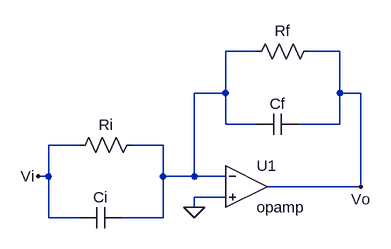
[diagram p0: schematic esercizio3.asc]
esercizio3.asc, the LTspice schematic file:
Version 4
SHEET 1 880 680
WIRE 224 -16 176 -16
WIRE 352 -16 304 -16
WIRE 176 48 176 -16
WIRE 176 48 128 48
WIRE 352 48 352 -16
WIRE 384 48 352 48
WIRE 176 96 176 48
WIRE 224 96 176 96
WIRE 352 96 352 48
WIRE 352 96 288 96
WIRE -48 128 -96 128
WIRE 80 128 32 128
WIRE -96 176 -96 128
WIRE -96 176 -112 176
WIRE 80 176 80 128
WIRE 128 176 128 48
WIRE 128 176 80 176
WIRE 176 176 128 176
WIRE 384 192 384 48
WIRE 384 192 240 192
WIRE 176 208 128 208
WIRE 128 224 128 208
WIRE -96 240 -96 176
WIRE -48 240 -96 240
WIRE 80 240 80 176
WIRE 80 240 16 240
FLAG 128 224 0
FLAG 384 192 Vo
FLAG -112 176 Vi
SYMBOL cap 16 224 R90
WINDOW 0 0 32 VBottom 2
WINDOW 3 32 32 VTop 2
SYMATTR InstName Ci
SYMATTR Value ""
SYMBOL cap 288 80 R90
WINDOW 0 0 32 VBottom 2
WINDOW 3 32 32 VTop 2
SYMATTR InstName Cf
SYMATTR Value ""
SYMBOL res 48 112 R90
WINDOW 0 0 56 VBottom 2
WINDOW 3 32 56 VTop 2
SYMATTR InstName Ri
SYMATTR Value ""
SYMBOL res 320 -32 R90
WINDOW 0 0 56 VBottom 2
WINDOW 3 32 56 VTop 2
SYMATTR InstName Rf
SYMATTR Value ""
SYMBOL OpAmps\\opamp 208 128 R0
SYMATTR InstName U1

The netlist it stands for:
* esercizio3.asc
Ci N001 Vi
Cf Vo N001
Ri N001 Vi
Rf Vo N001
XU1 N001 0 Vo opamp Aol=100K GBW=10Meg  ; pins invin noninvin out
.backanno
.end